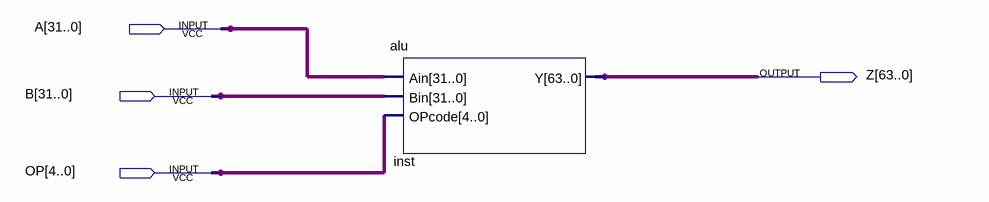
[diagram p0: schematic sheet]
// Quartus schematic alu_block.bdf as structural Verilog: 1 symbols, 4 pins
module alu_block (
  input  [31:0] A,
  input  [31:0] B,
  input  [4:0] OP,
  output [63:0] Z
);

  alu inst (.Ain(A), .Bin(B), .OPcode(OP), .Y(Z));
endmodule
